# Altium schematic sheet ATMega328P_weather_station_power.SchDoc
size A4; DocumentNumber: 2; SheetNumber: 2; SheetTotal: 2
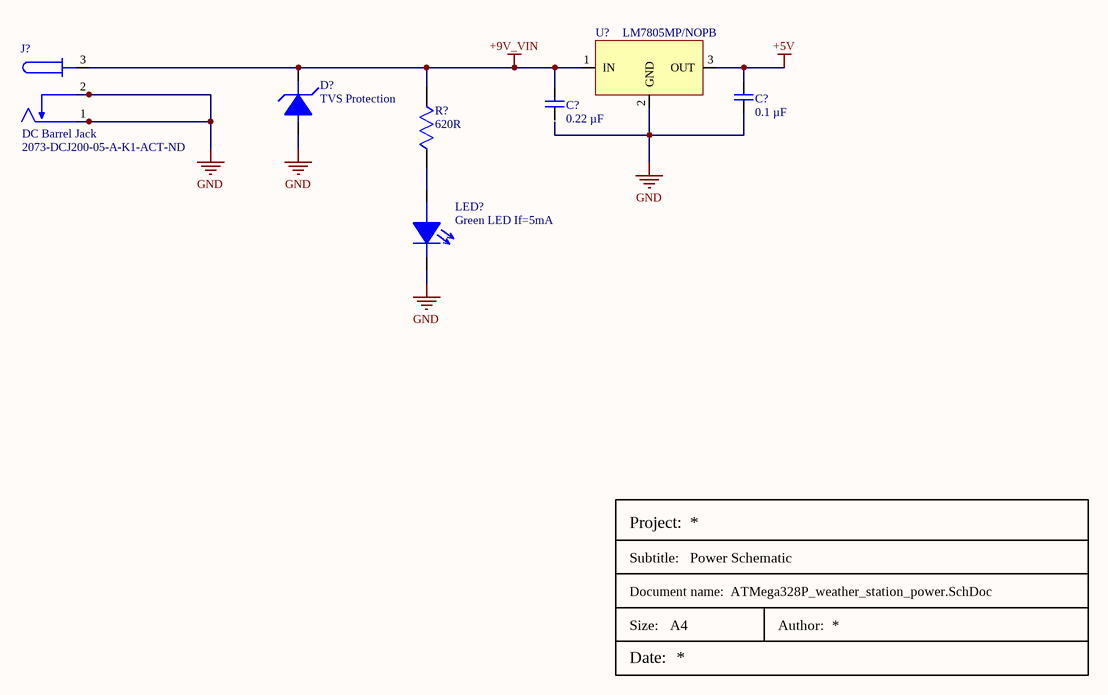
[diagram p0: ATMega328P_weather_station_power.SchDoc]

## Parts
*  Size: A4  Subtitle: Power Schematic  (hidden comment: Title Block)  (graphical)
C?  0.22 µF
D?  TVS Protection
J?  DC Barrel Jack  Supplier Part Number 1: 2073-DCJ200-05-A-K1-ACT-ND
LED?  Green LED If=5mA
R?  620R
U?  LM7805MP/NOPB
С?  0.1 µF

## Nets
+5V: U?.3(OUT) С?.2
+9V_VIN: C?.1 D?.2 J?.3(CENTER_(V+)) R?.2 U?.1(IN)
GND: D?.1 J?.1(GND) J?.2(SPRING_(GND)) LED?.2 U?.2(GND) С?.1
NetLED?_1: LED?.1 R?.1

Not connected (* = marked no-connect by the designer): C? 2

## Notes on the sheet
- (in symbol Title Block) Project:; Subtitle:; Document name:; Size:; Author:; Date:

## Library data of the parts
* = Title Block: Custom schematic title block
C? = 0603B224K160CT: 0.22 µF ±10% 16V Ceramic Capacitor X7R 0603 (1608 Metric); Manufacturer: Walsin Technologies; Supplier 1: Digikey; Manufacturer Part Number: 0603B224K160CT; RoHS: Yes; Category: Ceramic Capacitors; Stock 1: 104261; Pricing 1: 1=0,1, 10=0,034, 50=0,0192, 100=0,0149, 500=0,01124, 1000=0,00883 (USD); ComponentLink1URL: http://www.farnell.com/datasheets/2340522.pdf?src-supplier=Farnell; ComponentLink1Description: http://www.farnell.com/datasheets/2340522.pdf?src-supplier=Farnell; ComponentLink2URL: http://www.farnell.com/datasheets/2009679.pdf?src-supplier=Farnell; ComponentLink2Description: http://www.farnell.com/datasheets/2009679.pdf?src-supplier=Farnell; ComponentLink3URL: https://www.verical.com/server-webapp/html/getDatasheet?partID=415742&src-supplier=Verical; ComponentLink3Description: https://www.verical.com/server-webapp/html/getDatasheet?partID=415742&src-supplier=Verical; ComponentLink4URL: http://www.passivecomponent.com/wp-content/uploads/2018/10/MLCC.pdf?src-supplier=Digikey; ComponentLink4Description: http://www.passivecomponent.com/wp-content/uploads/2018/10/MLCC.pdf?src-supplier=Digikey; ComponentLink5URL: https://datasheet.octopart.com/0603B224K160CT-Walsin-Technologies-datasheet-85392065.pdf?src-supplier=Element14; ComponentLink5Description: https://datasheet.octopart.com/0603B224K160CT-Walsin-Technologies-datasheet-85392065.pdf?src-supplier=Element14; ComponentLink6URL: https://datasheet.octopart.com/0603B224K160CT-Walsin-Technologies-datasheet-128065749.pdf?src-supplier=Future+Electronics; ComponentLink6Description: https://datasheet.octopart.com/0603B224K160CT-Walsin-Technologies-datasheet-128065749.pdf?src-supplier=Future+Electronics; ComponentLink7URL: https://datasheet.octopart.com/0603B224K160CT-Walsin-Technologies-datasheet-62066062.pdf?src-supplier=TME; ComponentLink7Description: https://datasheet.octopart.com/0603B224K160CT-Walsin-Technologies-datasheet-62066062.pdf?src-supplier=TME; ComponentLink8URL: https://datasheet.octopart.com/0603B224K160CT-Walsin-Technologies-datasheet-136037192.pdf?src-supplier=TECHDesign; ComponentLink8Description: https://datasheet.octopart.com/0603B224K160CT-Walsin-Technologies-datasheet-136037192.pdf?src-supplier=TECHDesign; Supplier Part Number 1: 1292-1419-1-ND
D? = SMAJ10A: Unidirectional TVS protection. SMAJ Series 10 V 400 W SMT Uni-Directional Transient Voltage Suppressor - SMA; Manufacturer: Littelfuse; Supplier 1: Digikey; Manufacturer Part Number: SMAJ10A; RoHS: Yes; Category: TVS Diodes; Stock 1: 44201; Pricing 1: 1=0,4, 10=0,287, 100=0,1449, 500=0,12844, 1000=0,09996, 2000=0,08947 (USD); ComponentLink1URL: https://datasheet.ciiva.com/330/littelfuse-tvs-diode-smaj-datasheet-pdf-330790.pdf?src-supplier=Digikey; ComponentLink1Description: https://datasheet.ciiva.com/330/littelfuse-tvs-diode-smaj-datasheet-pdf-330790.pdf?src-supplier=Digikey; ComponentLink2URL: https://datasheet.ciiva.com/330/littelfuse-tvs-diode-smaj-datasheet-pdf-330791.pdf?src-supplier=Digikey; ComponentLink2Description: https://datasheet.ciiva.com/330/littelfuse-tvs-diode-smaj-datasheet-pdf-330791.pdf?src-supplier=Digikey; ComponentLink3URL: https://datasheet.ciiva.com/330/littelfuse-tvs-diode-smaj-datasheet-pdf-330792.pdf?src-supplier=Digikey; ComponentLink3Description: https://datasheet.ciiva.com/330/littelfuse-tvs-diode-smaj-datasheet-pdf-330792.pdf?src-supplier=Digikey; ComponentLink4URL: https://datasheet.ciiva.com/8062/littelfuse-tvs-diode-smaj-8062262.pdf?src-supplier=Element14; ComponentLink4Description: https://datasheet.ciiva.com/8062/littelfuse-tvs-diode-smaj-8062262.pdf?src-supplier=Element14; Supplier Part Number 1: SMAJ10ALFCT-ND
J? = DCJ200-05-A-K1-A: Power Barrel Connector Jack 2.05mm ID (0.081"), 5.50mm OD (0.217") Surface Mount, Right Angle; Manufacturer: Global Connector Technology; Supplier 1: Digikey; Manufacturer Part Number: DCJ200-05-A-K1-A; RoHS: Yes; Category: Connectors; Stock 1: 1981; Pricing 1: 1=1,02, 10=0,859, 25=0,8236, 50=0,806, 100=0,771 (USD); ComponentLink1URL: https://datasheet.octopart.com/DCJ200-05-A-K1-A-Global-Connector-Technology-datasheet-77992270.pdf?src-supplier=Future+Electronics; ComponentLink1Description: https://datasheet.octopart.com/DCJ200-05-A-K1-A-Global-Connector-Technology-datasheet-77992270.pdf?src-supplier=Future+Electronics; ComponentLink2URL: https://gct.co/files/drawings/dcj200-05.pdf?src-supplier=Digikey; ComponentLink2Description: https://gct.co/files/drawings/dcj200-05.pdf?src-supplier=Digikey; ComponentLink3URL: https://datasheet.octopart.com/DCJ200-05-A-K1-A-Global-Connector-Technology-datasheet-91940685.pdf?src-supplier=Farnell; ComponentLink3Description: https://datasheet.octopart.com/DCJ200-05-A-K1-A-Global-Connector-Technology-datasheet-91940685.pdf?src-supplier=Farnell; ComponentLink4URL: http://www.farnell.com/cad/1884037.pdf?src-supplier=Element14; ComponentLink4Description: http://www.farnell.com/cad/1884037.pdf?src-supplier=Element14
LED? = IN-S85CS5G: Side View / 0805 / 2.1 X 1.0 X 0; Manufacturer: Inolux; Supplier 1: Digikey; Manufacturer Part Number: IN-S85CS5G; RoHS: No; Category: LEDs; Stock 1: 5237; Pricing 1: 1=0,25, 10=0,166, 100=0,1109, 500=0,07668, 1000=0,0639 (USD); Supplier Part Number 1: 1830-IN-S85CS5GCT-ND
R? = LTR18EZPF6200: Res Thick Film 0612 620 Ohm 1% 1.5W ±100ppm/C Wide Terminal SMD T/R Automotive AEC-Q200; Manufacturer: Rohm; Max Power Dissipation: 750mW; Temperature Coefficient: 100ppm/°C; Voltage Rating: 200V; Supplier 1: Digikey; Manufacturer Part Number: LTR18EZPF6200; RoHS: No; Category: Chip SMD Resistors; Stock 1: 8335; Pricing 1: 1=0,2, 10=0,107, 50=0,073, 100=0,0629, 500=0,04618, 1000=0,0409 (USD); Case/Package: 0612; Case Code (Metric): 3216; Case Code (Imperial): 1206; Min Operating Temperature: -55°C; Max Operating Temperature: 155°C; Resistance: 620R; Tolerance: 1%; Packaging: Cut Tape; Number of Terminations: 2; Features: Automotive AEC-Q200; Series: LTR; Ratings: AEC-Q200; RoHS Compliant: No; ComponentLink1URL: https://datasheet.ciiva.com/2470/ltr-2470303.pdf?src-supplier=Digikey; ComponentLink1Description: https://datasheet.ciiva.com/2470/ltr-2470303.pdf?src-supplier=Digikey; ComponentLink2URL: https://datasheet.ciiva.com/2470/ltr-2470304.pdf?src-supplier=Digikey; ComponentLink2Description: https://datasheet.ciiva.com/2470/ltr-2470304.pdf?src-supplier=Digikey; ComponentLink3URL: https://datasheet.ciiva.com/2470/ltr-2470305.pdf?src-supplier=Digikey; ComponentLink3Description: https://datasheet.ciiva.com/2470/ltr-2470305.pdf?src-supplier=Digikey; Supplier Part Number 1: RHM620YCT-ND
U? = LM7805MP/NOPB: 1.5-A, 30-V, linear voltage regulator 4-SOT-223 0 to 125; Manufacturer: Texas Instruments; Dropout Voltage: 2V; Accuracy: 3%; Max Supply Voltage: 30V; Min Supply Voltage: 7.5V; Nominal Supply Current: 8mA; Number of Outputs: 1NUMBER; Output Voltage: 5V; Supplier 1: Digikey; Manufacturer Part Number: LM7805MP/NOPB; RoHS: Yes; Category: Voltage Regulators - Linear; Stock 1: 2585; Pricing 1: 1=1,73, 10=1,555, 25=1,4672, 100=1,2499, 250=1,1736, 500=1,02692 (USD); Number of Pins: 4NUMBER; Length: 6.5mm; Width: 3.5mm; Height: 1.8mm; Thickness: 1.6mm; Lead Free: 5698LeadFree; ComponentLink1URL: http://www.ti.com/general/docs/suppproductinfo.tsp?distId=10&amp;gotoUrl=http%3A%2F%2Fwww.ti.com%2Flit%2Fgpn%2Flm340&src-supplier=Digikey; ComponentLink1Description: http://www.ti.com/general/docs/suppproductinfo.tsp?distId=10&amp;gotoUrl=http%3A%2F%2Fwww.ti.com%2Flit%2Fgpn%2Flm340&src-supplier=Digikey; Supplier Part Number 1: 296-44517-1-ND
С? = C0603X5R1C104K030BC: 0.1 µF ±10% 16V Ceramic Capacitor X5R 0201 (0603 Metric); Manufacturer: TDK; Capacitance: 100nF; Supplier 1: Digikey; Manufacturer Part Number: C0603X5R1C104K030BC; RoHS: Yes; Category: Ceramic Capacitors; Stock 1: 3242475; Pricing 1: 1=0,1, 10=0,044, 50=0,0252, 100=0,0195, 500=0,01468, 1000=0,01153, 2500=0,01048, 5000=0,00964 (USD); Mount: Surface Mount; Case/Package: 0201; Case Code (Metric): 0603; Case Code (Imperial): 0201; Weight: 6E-06oz; Dielectric Material: Ceramic; Material: 4241ConductorMaterial; Min Operating Temperature: -55°C; Max Operating Temperature: 85°C; Voltage Rating: 16V; Tolerance: 10%; Packaging: Tape and Reel; Package Quantity: 15000; Dielectric: X5R; Voltage: 16V; Dissipation Factor: 10%; Termination: SMD/SMT; Voltage Rating (DC): 16V; Series: C; Construction: Flat; Length: 0.6mm; Width: 0.3mm; Height: 0.3mm; Depth: 0.3mm; RoHS Compliant: Yes; Reach SVHC Compliant: Unknown; Lead Free: 5697LeadFree; ComponentLink1URL: https://datasheet.ciiva.com/22725/1913358-22725406.pdf?src-supplier=Element14; ComponentLink1Description: https://datasheet.ciiva.com/22725/1913358-22725406.pdf?src-supplier=Element14; ComponentLink2URL: https://datasheet.ciiva.com/22725/1913358-22725407.pdf?src-supplier=Element14; ComponentLink2Description: https://datasheet.ciiva.com/22725/1913358-22725407.pdf?src-supplier=Element14; ComponentLink3URL: https://datasheet.ciiva.com/6250/tdkmlcccaprange-6250616.pdf?src-supplier=Digikey; ComponentLink3Description: https://datasheet.ciiva.com/6250/tdkmlcccaprange-6250616.pdf?src-supplier=Digikey; ComponentLink4URL: https://datasheet.ciiva.com/6250/tdkmlcccaprange-6250614.pdf?src-supplier=Digikey; ComponentLink4Description: https://datasheet.ciiva.com/6250/tdkmlcccaprange-6250614.pdf?src-supplier=Digikey; ComponentLink5URL: https://datasheet.ciiva.com/6250/tdkmlcccaprange-6250618.pdf?src-supplier=Digikey; ComponentLink5Description: https://datasheet.ciiva.com/6250/tdkmlcccaprange-6250618.pdf?src-supplier=Digikey; Supplier Part Number 1: 445-7313-1-ND